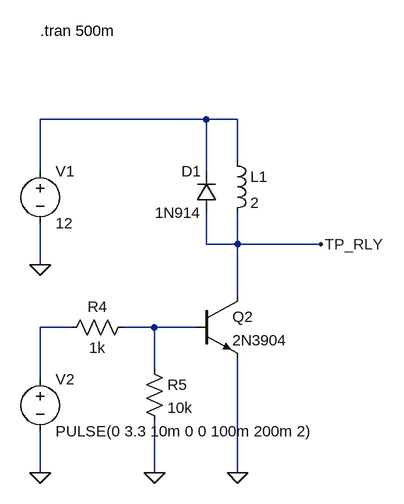
[diagram p0: schematic 4020 Relay Control 1.asc]
4020 Relay Control 1.asc, the LTspice schematic file:
Version 4
SHEET 1 880 680
WIRE 16 -288 -240 -288
WIRE 64 -288 16 -288
WIRE 64 -224 64 -288
WIRE -240 -208 -240 -288
WIRE 16 -208 16 -288
WIRE 16 -96 16 -144
WIRE 64 -96 64 -144
WIRE 64 -96 16 -96
WIRE 192 -96 64 -96
WIRE -240 -64 -240 -128
WIRE 64 -16 64 -96
WIRE -192 32 -240 32
WIRE -64 32 -112 32
WIRE 0 32 -64 32
WIRE -64 96 -64 32
WIRE -240 112 -240 32
WIRE -240 256 -240 192
WIRE -64 256 -64 176
WIRE 64 256 64 80
FLAG -240 -64 0
FLAG -240 256 0
FLAG 64 256 0
FLAG -64 256 0
FLAG 192 -96 TP_RLY
SYMBOL voltage -240 -224 R0
WINDOW 123 0 0 Left 0
WINDOW 39 0 0 Left 0
SYMATTR InstName V1
SYMATTR Value 12
SYMBOL voltage -240 96 R0
WINDOW 123 0 0 Left 0
WINDOW 39 0 0 Left 0
SYMATTR InstName V2
SYMATTR Value PULSE(0 3.3 10m 0 0 100m 200m 2)
SYMBOL npn 0 -16 R0
SYMATTR InstName Q2
SYMATTR Value 2N3904
SYMBOL res -96 16 R90
WINDOW 0 0 56 VBottom 2
WINDOW 3 32 56 VTop 2
SYMATTR InstName R4
SYMATTR Value 1k
SYMBOL res -80 80 R0
SYMATTR InstName R5
SYMATTR Value 10k
SYMBOL diode 32 -144 R180
WINDOW 0 24 64 Left 2
WINDOW 3 24 0 Left 2
SYMATTR InstName D1
SYMATTR Value 1N914
SYMBOL ind 48 -240 R0
SYMATTR InstName L1
SYMATTR Value 2
SYMATTR SpiceLine Rser=340
TEXT -240 -424 Left 2 !.tran 500m

The netlist it stands for:
* 4020 Relay Control 1.asc
V1 N001 0 12
V2 N002 0 PULSE(0 3.3 10m 0 0 100m 200m 2)
Q2 TP_RLY N003 0 0 2N3904
R4 N003 N002 1k
R5 N003 0 10k
D1 TP_RLY N001 1N914
L1 N001 TP_RLY 2 Rser=340
.model D D
.lib standard.dio
.model NPN NPN
.model PNP PNP
.lib standard.bjt
.tran 500m
.backanno
.end